# EAGLE design multivideo (EAGLE 7.3.0)
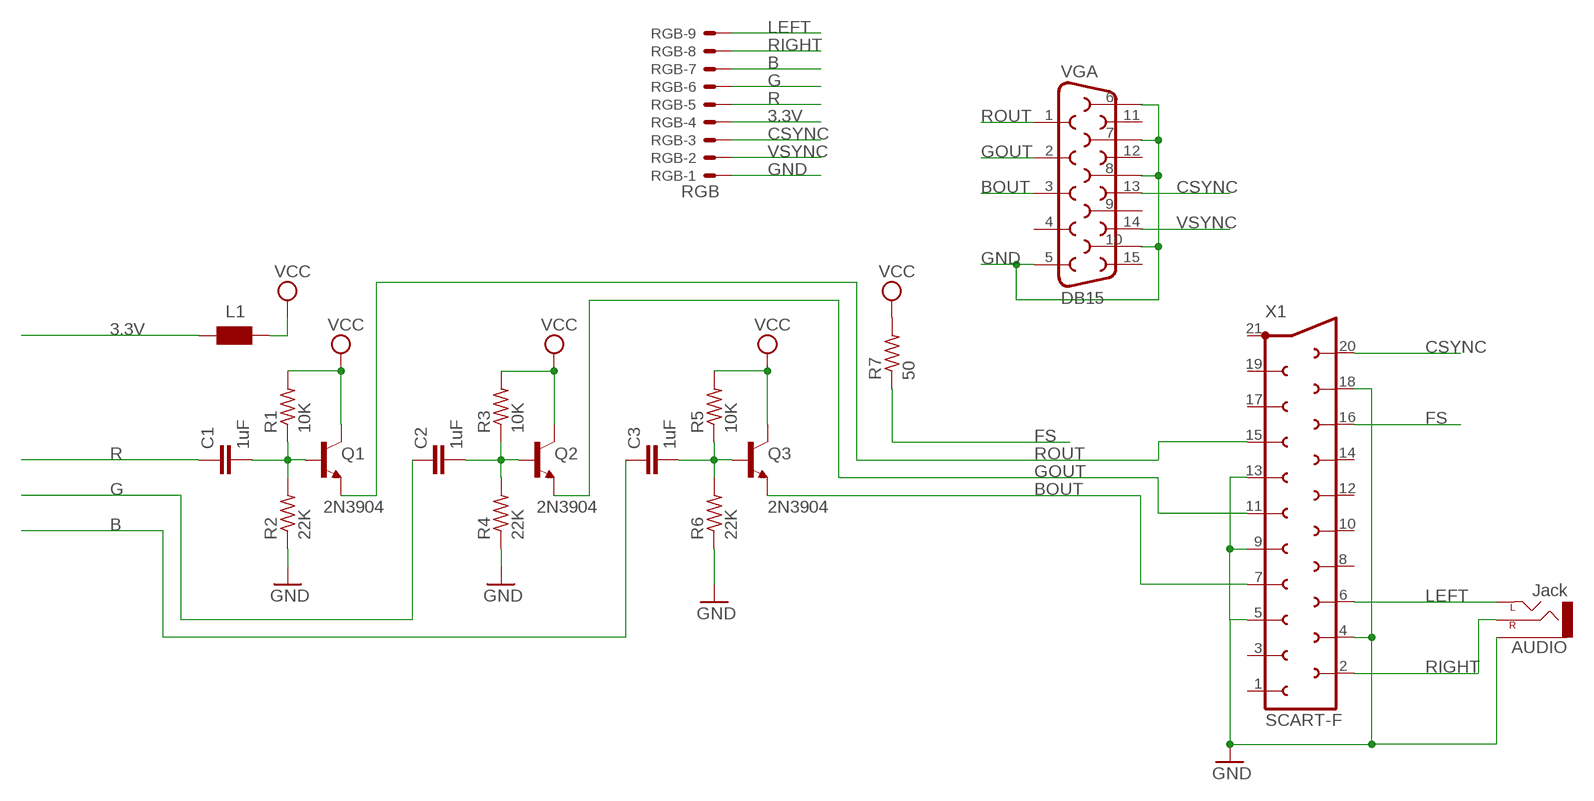
[diagram p0: schematic, sheet 1]

## Parts
AUDIO  Jack  AUDIO-JACKPTH  [AUDIO-JACK]
C1  1uF  C-EUC1206K  [C1206K]
C2  1uF  C-EUC1206K  [C1206K]
C3  1uF  C-EUC1206K  [C1206K]
L1  WE-CBF_0805  [0805]
Q1  2N3904  BC847CSMD  [SOT23]
Q2  2N3904  BC847CSMD  [SOT23]
Q3  2N3904  BC847CSMD  [SOT23]
R1  10K  R-US_R0805  [R0805]
R2  22K  R-US_R0805  [R0805]
R3  10K  R-US_R0805  [R0805]
R4  22K  R-US_R0805  [R0805]
R5  10K  R-US_R0805  [R0805]
R6  22K  R-US_R0805  [R0805]
R7  50  R-US_R0805  [R0805]
RGB  RGB  53048-09  [53048-09]
VGA  DB15  [DB15]
X1  SCART-F  [SCART-F]

## Nets
3.3V: L1.1 RGB.4
B: C3.1 RGB.7
BOUT: Q3.2(E) VGA.3 X1.7
CSYNC: RGB.3 VGA.13 X1.20
FS: R7.1 X1.16
G: C2.1 RGB.6
GND: AUDIO.SLEEVE R2.1 R4.1 R6.1 RGB.1 VGA.5 VGA.6 VGA.7 VGA.8 VGA.10 X1.4 X1.5 X1.9 X1.13 X1.18
GOUT: Q2.2(E) VGA.2 X1.11
LEFT: AUDIO.TIP(LEFT) RGB.9 X1.6
N$4: C1.2 Q1.1(B) R1.1 R2.2
N$8: C3.2 Q3.1(B) R5.1 R6.2
N$11: C2.2 Q2.1(B) R3.1 R4.2
R: C1.1 RGB.5
RIGHT: AUDIO.RING(RIGHT) RGB.8 X1.2
ROUT: Q1.2(E) VGA.1 X1.15
VCC: L1.2 Q1.3(C) Q2.3(C) Q3.3(C) R1.2 R3.2 R5.2 R7.2
VSYNC: RGB.2 VGA.14
Unconnected: VGA.4 VGA.9 VGA.11 VGA.12 VGA.15 X1.1 X1.3 X1.8 X1.10 X1.12 X1.14 X1.17 X1.19 X1.21

## Library data of the parts
AUDIO = SparkFun-Connectors:AUDIO-JACK: 3.5mm Audio Jack Simple 3.5mm common PCB mount audio jack. SKU: PRT-08032
C1-C3 = rcl:C-EU: CAPACITOR, European symbol
L1 = wuerth-elektronik:WE-CBF: SMD EMI Suppression Ferrite Beads - excellent anti-EMI properties - low DCR - impedances till 3000 ohms - rated current up to 6 A
Q1-Q3 = transistor-npn:BC847*: NPN Transistor
R1-R7 = adafruit:R-US_: RESISTOR, American symbol
RGB = con-molex:53?-09: CONNECTOR wire to board 1.25 mm (.049 inch) pitch header; MPN: 53048-0910; OC_FARNELL: 1012239; OC_NEWARK: 98K9837
VGA = SparkFun-Connectors:DB15: DB15 / VGA right angle through-hole female connector.
X1 = con-hirschmann:SCART-F: TV SCART CONNECTOR; OC_FARNELL: unknown; OC_NEWARK: unknown

## Board
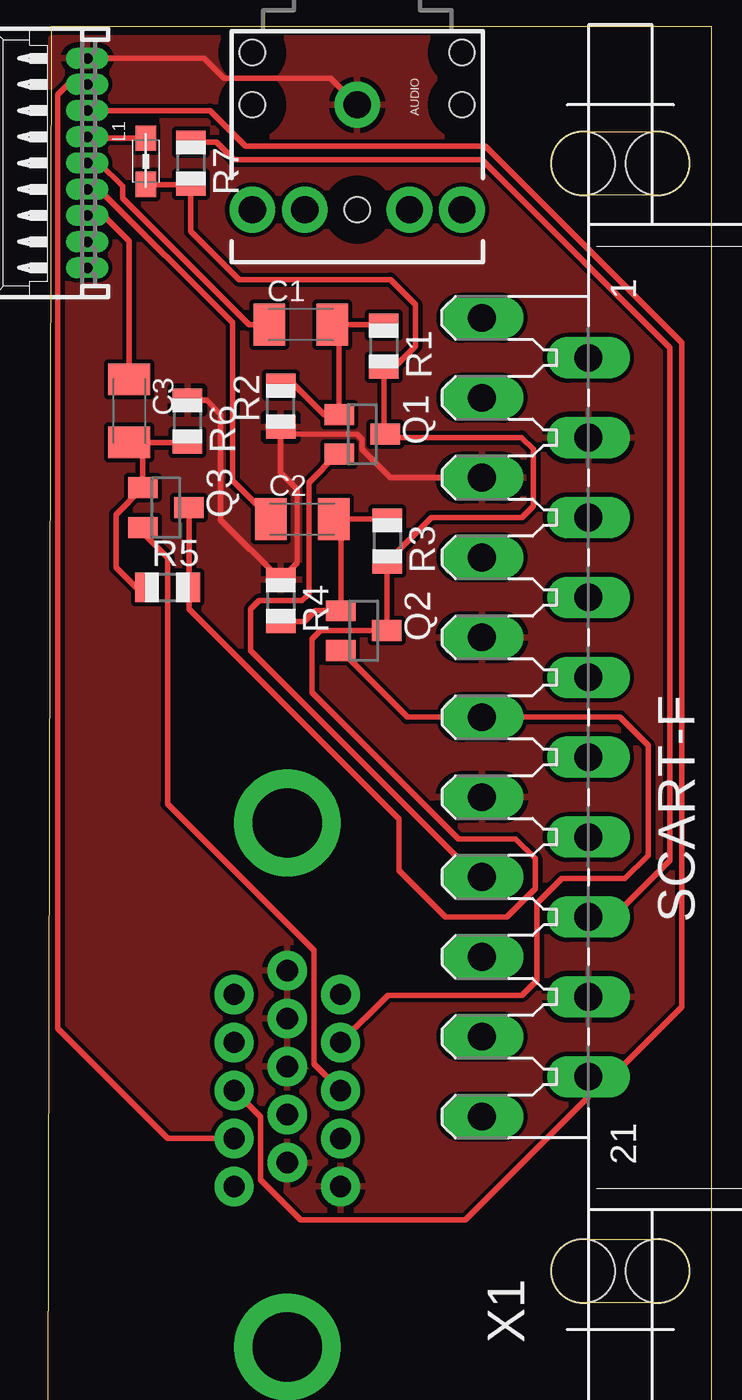
[diagram p1: board, top side]
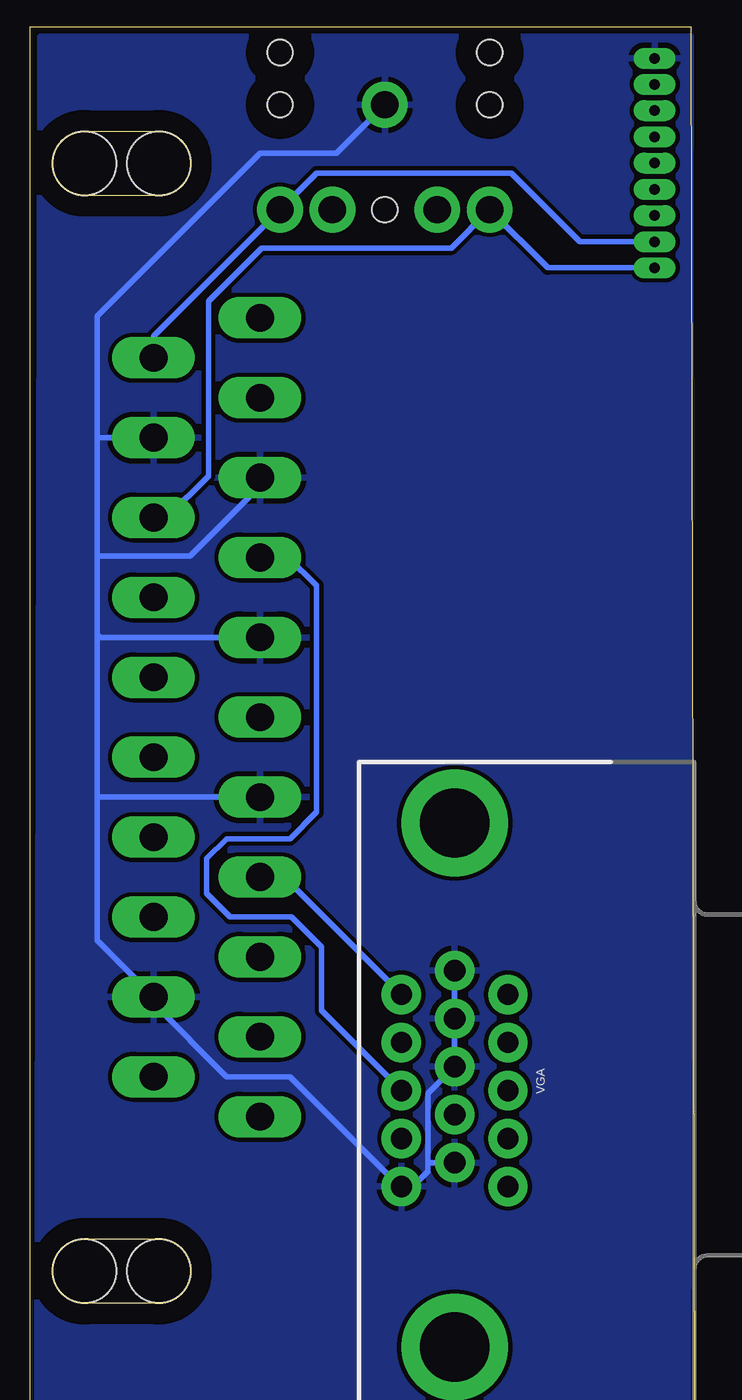
[diagram p2: board, bottom side, seen from below]

Size 6.6 x 55.88 mm. Coordinates in mm from the lower left corner, seen from the top.
Copper layers (1*16): Top 0.035mm / dielectric 1.5mm / Bottom 0.035mm
Design rules "default": minimum track width 10mil, minimum drill 24mil, track to track 8mil, track to pad 8mil, pad to pad 8mil, via to via 8mil, smd to smd 8mil, copper to edge 40mil, drill to drill 8mil, minimum pad ring 10mil, minimum via ring 8mil, stop-mask expansion 4mil, vias tented up to drill 0mil, thermal gap 10mil
Milling: 4 lines

### Footprints (pad centres in the part's own frame; a part is rotated, then mirrored left to right if it is on the bottom)
AUDIO-JACK = drill 1.3 pad 2.184: RING 5,5; RSH 5,2.5; SLEEVE 0,0; TIP 5,-5; TSH 5,-2.5 | hole 1.2: 0,5; -2.5,5; -2.5,-5; 0,-5; 5,0
C1206K = smd 1.5 x 2: 1 -1.5,0; 2 1.5,0
0805 = smd 1.2 x 1: 1 -1.1,0; 2 1.1,0
SOT23 = smd 1 x 1.4: 1 -0.95,-1.1; 2 0.95,-1.1; 3 0,1.1
R0805 = smd 1.1 x 1.4: 1 -1,0; 2 1,0
53048-09 = drill 0.5 pad 0.698 long: 1 5,-1.25; 2 3.75,-1.25; 3 2.5,-1.25; 4 1.25,-1.25; 5 0,-1.25; 6 -1.25,-1.25; 7 -2.5,-1.25; 8 -3.75,-1.25; 9 -5,-1.25
DB15 = drill 1.016 pad 1.88: 1 -4.32,-7.62; 2 -2.03,-7.62; 3 0.26,-7.62; 4 2.55,-7.62; 5 4.84,-7.62; 6 -5.46,-5.08; 7 -3.17,-5.08; 8 -0.88,-5.08; 9 1.41,-5.08; 10 3.7,-5.08; 11 -4.32,-2.54; 12 -2.03,-2.54; 13 0.26,-2.54; 14 2.55,-2.54; 15 4.84,-2.54 | drill 3.302 pad 5.08: G1 -12.5,-5.08; G2 12.5,-5.08
SCART-F = drill 1.321 long: 1 19.05,5.08; 2 17.145,0; 3 15.24,5.08; 4 13.335,0; 5 11.43,5.08; 6 9.525,0; 7 7.62,5.08; 8 5.715,0; 9 3.81,5.08; 10 1.905,0; 11 0,5.08; 12 -1.905,0; 13 -3.81,5.08; 14 -5.715,0; 15 -7.62,5.08; 16 -9.525,0; 17 -11.43,5.08; 18 -13.335,0; 19 -15.24,5.08; 20 -17.145,0; 21 -19.05,5.08 | hole 3.023: 26.416,0.254; 26.416,-3.302; -26.416,0.254; -26.416,-3.302

### Placement (x,y rotation side)
AUDIO  -9.26,57.15 270 top  (outside the outline)
C1  -11.95,46.67 0 top  (outside the outline)
C2  -11.87,37.39 0 top  (outside the outline)
C3  -20.13,42.55 270 top  (outside the outline)
L1  -19.34,54.45 270 top  (outside the outline)
Q1  -9.02,41.43 270 top  (outside the outline)
Q2  -8.94,32.07 270 top  (outside the outline)
Q3  -18.38,37.94 270 top  (outside the outline)
R1  -7.99,45.64 270 top  (outside the outline)
R2  -12.91,42.78 90 top  (outside the outline)
R3  -7.83,36.35 270 top  (outside the outline)
R4  -12.91,33.5 270 top  (outside the outline)
R5  -18.3,34.13 0 top  (outside the outline)
R6  -17.35,42.07 270 top  (outside the outline)
R7  -17.19,54.37 270 top  (outside the outline)
RGB  -23.38,54.37 90 top  (outside the outline)
VGA  -17.67,10.4 270 bottom  (outside the outline)
X1  1.78,27.94 90 top

### Tracks (layer width: path | path; a pad name or v marks a point on that pad's centre or on a via)
3.3V
  Top 0.254: L1.1 -22.06,55.55 RGB.4
B
  Top 0.254: RGB.7 -21.36,51.87 -20.13,50.64 C3.1
BOUT
  Top 0.254: Q3.2 -19.48,36.74 -18.3,35.56 -18.3,23.81 -11.32,16.83 -11.32,11.41 VGA.3
  Bottom 0.254: VGA.3 -6.24,13.95 -6.24,16.99 -4.81,18.41 -1.87,18.41 -0.76,19.53 -0.76,21.19 -1.71,22.15 -4.73,22.15 -6,23.42 -6,34.21 -4.65,35.56 X1.7
CSYNC
  Top 0.254: RGB.3 -16.28,56.87 -14.57,55.17 -3.14,55.17 6.22,45.8 6.22,14.13 2.89,10.79 X1.20 1.78,9.84 -4.1,3.97 -11.95,3.97 -13.86,5.87 -13.86,8.89 -15.11,10.14 VGA.13
FS
  Top 0.254: R7.1 -15.97,55.37 -15.13,54.53 -3.3,54.53 5.67,45.56 5.67,21.11 2.97,18.41 X1.16
G
  Top 0.254: RGB.6 -21.58,53.12 -15.21,46.75 -15.21,39.22 C2.1
GND
  Top 0.254: RGB.1 -16.56,59.37 -15.6,58.42 -10.52,58.42 AUDIO.SLEEVE | R6.1 -16.45,43.07 -15.76,42.39 -15.76,37.35 R4.1 -12.11,35.29 -12.11,38.81 -12.91,39.61 R2.1 -12.56,41.43 -9.25,41.43 -9.02,41.2 -9.02,40.72 -7.67,39.37 X1.5
  Bottom 0.254: X1.5 -3.3,38.97 0.03,35.64 4.4,35.64 4.48,35.56 | VGA.6 VGA.7 VGA.8 -11.32,10 -11.32,6.67 | -11.32,6.67 -11.32,6.27 -10.6,5.56 VGA.5 -9.97,5.56 -4.73,10.79 -1.71,10.79 1.78,14.29 X1.18 4.48,17.3 4.48,24.21 | VGA.10 -11.35,6.7 -11.32,6.67 | 4.48,41.35 4.48,47.07 -3.3,54.85 -6.95,54.85 AUDIO.SLEEVE | X1.4 4.4,41.27 4.48,41.35 | 4.48,41.35 4.48,35.56 | 4.48,35.56 4.48,31.91 | 4.48,31.91 4.48,24.21 | X1.9 4.32,31.75 4.48,31.91 | X1.13 4.4,24.13 4.48,24.21
  pour Bottom: -23.86,60.4 7.18,60.4 7.33,-4.76 -23.7,-4.76
  pour Top: -23.86,60.33 7.18,60.33 7.33,-4.76 -23.7,-4.76
GOUT
  Top 0.254: Q2.2 -6.86,27.94 X1.11 3.29,27.94 4.64,26.59 4.64,21.35 3.52,20.24 0.51,20.24 -0.68,19.05 -0.68,15.4 -1.4,14.68 -7.79,14.68 VGA.2
LEFT
  Bottom 0.254: RGB.9 -17.03,49.37 AUDIO.TIP -12.43,50.32 -3.38,50.32 -0.84,47.78 -0.84,39.45 1.14,37.47 X1.6
N$4
  Top 0.254: R1.1 -8.02,46.67 C1.2 -10.12,46.34 Q1.1 -10.84,42.38 -12.27,43.81 -12.87,43.81 R2.2
N$8
  Top 0.254: C3.2 -19.49,41.05 | R6.2 -17.37,41.05 -19.49,41.05 | -19.49,41.05 -19.49,40.4 -19.48,40.39 Q3.1 -20.76,37.61 -20.76,35.08 -19.81,34.13 R5.1
N$11
  Top 0.254: R3.1 -7.86,37.39 C2.2 -10.04,37.05 Q2.1 -11.24,33.02 -11.76,32.5 R4.2
R
  Top 0.254: C1.1 -14.41,46.67 -20.45,52.7 -20.45,53.26 -21.56,54.37 RGB.5
RIGHT
  Bottom 0.254: RGB.8 -18.56,50.62 -15.29,53.9 -6,53.9 AUDIO.RING 1.78,46.12 X1.2
ROUT
  Top 0.254: Q1.2 -10.2,40.48 -11.56,39.13 -11.56,33.81 -11.87,33.5 -13.94,33.5 -14.33,33.1 -14.33,31.11 -3.54,20.32 X1.15
  Bottom 0.254: VGA.1 -4.45,20.32 X1.15
VCC
  Top 0.254: L1.2 -17.21,53.35 R7.2 -17.19,51.12 -14.89,48.82 -7.67,48.82 -6.48,47.62 -6.48,45.64 -7.43,44.69 -7.94,44.69 R1.2 -7.98,41.5 Q1.3 -7.92,41.29 -1.41,41.29 -0.84,40.72 -0.84,38.02 -1.4,37.47 -5.71,37.47 R3.2 Q2.3 -11,32.07 -11.4,31.67 -11.4,29.13 -4.41,22.15 -1.71,22.15 -0.76,21.19 -0.76,19.76 -2.11,18.41 -5.05,18.41 -7.27,20.64 -7.27,23.1 -17.27,33.1 -17.27,34.1 R5.2 -17.28,34.15 Q3.3
VSYNC
  Top 0.254: RGB.2 -23.05,58.12 -23.54,57.63 -23.54,13.1 -18.3,7.86 VGA.14